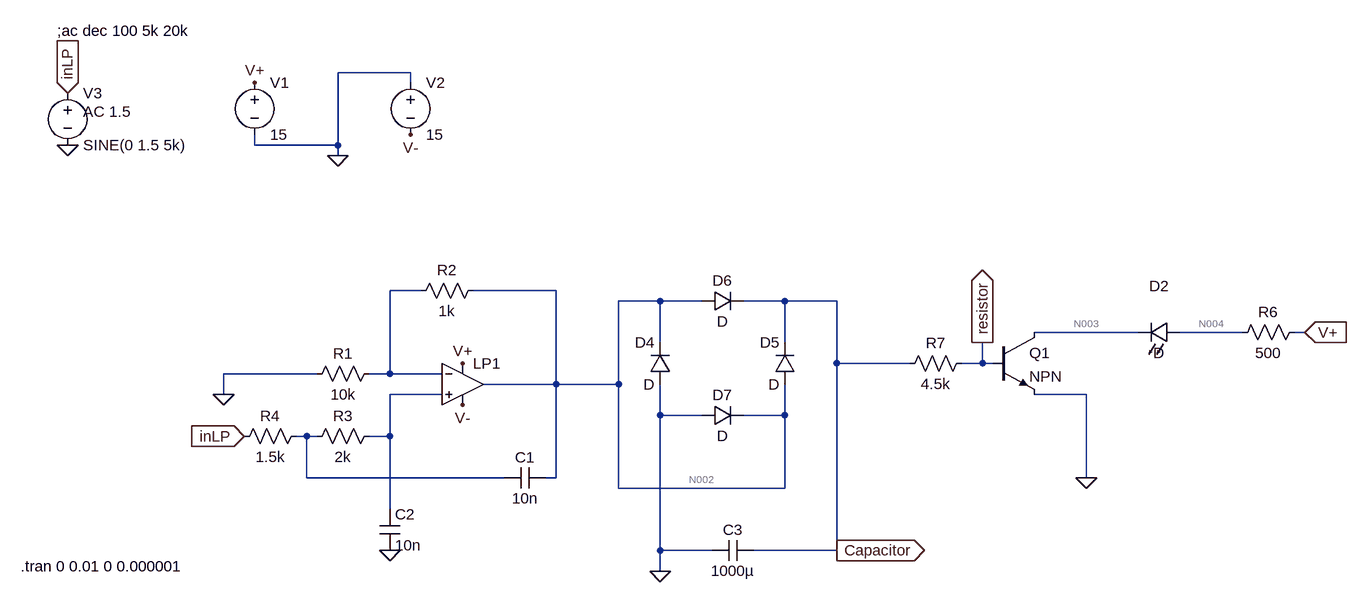
[diagram p0: schematic Draft1.asc]
Draft1.asc, the LTspice schematic file:
Version 4
SHEET 1 1548 680
WIRE -480 -368 -592 -368
WIRE -480 -352 -480 -368
WIRE -720 -256 -720 -272
WIRE -592 -256 -592 -368
WIRE -592 -256 -720 -256
WIRE -592 -240 -592 -256
WIRE -464 -32 -512 -32
WIRE -256 -32 -384 -32
WIRE -96 -16 -160 -16
WIRE -32 -16 -96 -16
WIRE 96 -16 32 -16
WIRE 176 -16 96 -16
WIRE 640 32 480 32
WIRE 800 32 704 32
WIRE 896 32 880 32
WIRE -96 48 -96 -16
WIRE 96 48 96 -16
WIRE 176 80 176 -16
WIRE 288 80 176 80
WIRE 400 80 400 48
WIRE 400 80 368 80
WIRE 416 80 400 80
WIRE -624 96 -768 96
WIRE -512 96 -512 -32
WIRE -512 96 -544 96
WIRE -432 96 -512 96
WIRE -256 112 -256 -32
WIRE -256 112 -368 112
WIRE -160 112 -160 -16
WIRE -160 112 -256 112
WIRE -768 128 -768 96
WIRE -432 128 -512 128
WIRE 560 128 480 128
WIRE -96 160 -96 112
WIRE -32 160 -96 160
WIRE 96 160 96 112
WIRE 96 160 32 160
WIRE -640 192 -656 192
WIRE -624 192 -640 192
WIRE -512 192 -512 128
WIRE -512 192 -544 192
WIRE -640 256 -640 192
WIRE -336 256 -640 256
WIRE -256 256 -256 112
WIRE -256 256 -272 256
WIRE 560 256 560 128
WIRE -160 272 -160 112
WIRE 96 272 96 160
WIRE 96 272 -160 272
WIRE -512 304 -512 192
WIRE -96 368 -96 160
WIRE -16 368 -96 368
WIRE 176 368 176 80
WIRE 176 368 48 368
WIRE -96 400 -96 368
FLAG -400 80 V+
FLAG -768 128 0
FLAG -512 368 0
FLAG -400 144 V-
FLAG -592 -240 0
FLAG -720 -352 V+
FLAG -480 -272 V-
FLAG -1008 -336 inLP
IOPIN -1008 -336 In
FLAG -1008 -256 0
FLAG -736 192 inLP
IOPIN -736 192 In
FLAG 896 32 V+
IOPIN 896 32 In
FLAG -96 400 0
FLAG 560 256 0
FLAG 176 368 Capacitor
IOPIN 176 368 Out
FLAG 400 48 resistor
IOPIN 400 48 Out
SYMBOL OpAmps/UniversalOpAmp -400 112 R0
SYMATTR InstName LP1
SYMBOL res -528 80 R90
WINDOW 0 0 56 VBottom 2
WINDOW 3 32 56 VTop 2
SYMATTR InstName R1
SYMATTR Value 10k
SYMBOL res -368 -48 R90
WINDOW 0 0 56 VBottom 2
WINDOW 3 32 56 VTop 2
SYMATTR InstName R2
SYMATTR Value 1k
SYMBOL res -528 176 R90
WINDOW 0 0 56 VBottom 2
WINDOW 3 32 56 VTop 2
SYMATTR InstName R3
SYMATTR Value 2k
SYMBOL res -640 176 R90
WINDOW 0 0 56 VBottom 2
WINDOW 3 32 56 VTop 2
SYMATTR InstName R4
SYMATTR Value 1.5k
SYMBOL cap -272 240 R90
WINDOW 0 0 32 VBottom 2
WINDOW 3 32 32 VTop 2
SYMATTR InstName C1
SYMATTR Value 10n
SYMBOL cap -528 304 R0
SYMATTR InstName C2
SYMATTR Value 10n
SYMBOL voltage -720 -368 R0
SYMATTR InstName V1
SYMATTR Value 15
SYMBOL voltage -480 -368 R0
SYMATTR InstName V2
SYMATTR Value 15
SYMBOL voltage -1008 -352 R0
WINDOW 123 24 44 Left 2
WINDOW 39 0 0 Left 0
SYMATTR Value2 AC 1.5
SYMATTR InstName V3
SYMATTR Value SINE(0 1.5 5k)
SYMBOL cap 48 352 R90
WINDOW 0 0 32 VBottom 2
WINDOW 3 32 32 VTop 2
SYMATTR InstName C3
SYMATTR Value 1000µ
SYMBOL npn 416 32 R0
SYMATTR InstName Q1
SYMBOL LED 704 48 M270
WINDOW 0 72 32 VTop 2
WINDOW 3 0 32 VBottom 2
SYMATTR InstName D2
SYMBOL res 896 16 R90
WINDOW 0 0 56 VBottom 2
WINDOW 3 32 56 VTop 2
SYMATTR InstName R6
SYMATTR Value 500
SYMBOL res 384 64 R90
WINDOW 0 0 56 VBottom 2
WINDOW 3 32 56 VTop 2
SYMATTR InstName R7
SYMATTR Value 4.5k
SYMBOL diode -80 112 R180
WINDOW 0 24 64 Left 2
WINDOW 3 24 0 Left 2
SYMATTR InstName D4
SYMBOL diode 112 112 R180
WINDOW 0 24 64 Left 2
WINDOW 3 24 0 Left 2
SYMATTR InstName D5
SYMBOL diode -32 0 R270
WINDOW 0 32 32 VTop 2
WINDOW 3 0 32 VBottom 2
SYMATTR InstName D6
SYMBOL diode -32 176 R270
WINDOW 0 32 32 VTop 2
WINDOW 3 0 32 VBottom 2
SYMATTR InstName D7
TEXT -1024 -432 Left 2 !;ac dec 100 5k 20k
TEXT -1080 392 Left 2 !.tran 0 0.01 0 0.000001

The netlist it stands for:
* Draft1.asc
XLP1 N005 N001 V+ V- N002 level1 Avol=1Meg GBW=10Meg Vos=0 En=0 Enk=0 In=0 Ink=0 Rin=500Meg  ; pins In+ In- V+ V- OUT
R1 N001 0 10k
R2 N002 N001 1k
R3 N005 N006 2k
R4 N006 inLP 1.5k
C1 N002 N006 10n
C2 N005 0 10n
V1 V+ 0 15
V2 0 V- 15
V3 inLP 0 SINE(0 1.5 5k) AC 1.5
C3 Capacitor 0 1000µ
Q1 N003 resistor 0 0 NPN
D2 N004 N003 D
R6 V+ N004 500
R7 resistor Capacitor 4.5k
D4 0 N002 D
D5 N002 Capacitor D
D6 N002 Capacitor D
D7 0 N002 D
.model D D
.lib standard.dio
.model NPN NPN
.model PNP PNP
.lib standard.bjt
;ac dec 100 5k 20k
.tran 0 0.01 0 0.000001
.lib UniversalOpAmp1.lib
.backanno
.end

* Results of the author's LTspice run, read from the files saved beside the schematic
* Operating Point, zero values left out:
*   V(v+) = 15 V
*   V(v-) = -15 V
*   V(capacitor) = 423.6 mV
*   V(n003) = 14.69 V
*   V(resistor) = 423.6 mV
*   V(n004) = 15 V
*   Ic(Q1) = 1.312 nA
*   Ie(Q1) = -1.311 nA
*   I(D2) = 1.344 nA
*   I(R6) = 1.312 nA
*   I(V1) = -31.31 nA
*   I(V2) = -30 nA
*   Ix(lp1:3) = 30 nA
*   Ix(lp1:4) = -30 nA
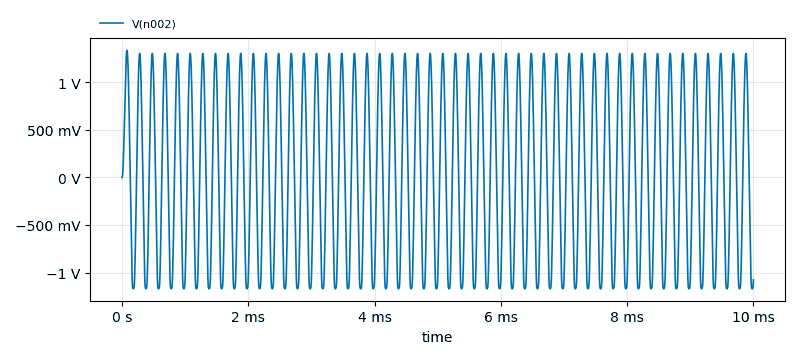
[diagram p1: Transient Analysis of Draft1.asc, plotted from the saved traces]
* Transient Analysis, 1 run:
*   V(n002): min -1.171 V, max 1.334 V, average 14.15 mV, rms 901.6 mV, last -1.077 V